# Altium schematic sheet MCU_SCH.SchDoc
size A; SheetNumber: 2; SheetTotal: 3
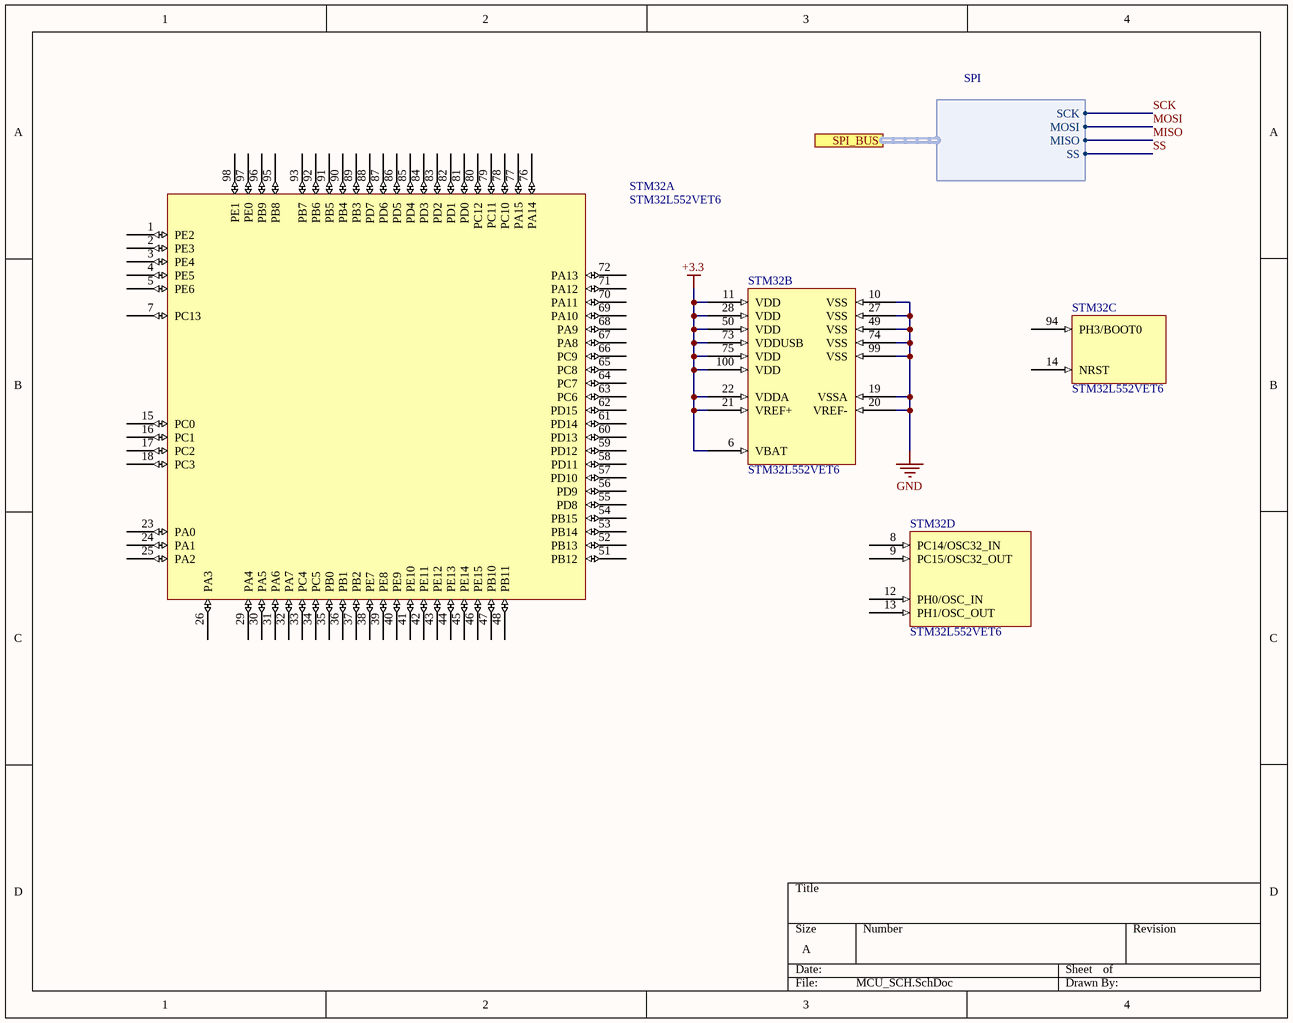
[diagram p0: MCU_SCH.SchDoc]

## Parts
STM32  STM32L552VET6  [TSQFP50P1600X1600X160-100N]  (parts A,B,C,D of 4)

## Ports
SPI_BUS (harness SPI)

## Harnesses
SPI: SCK, MOSI, MISO, SS

## Nets
+3.3: STM32.6(VBAT) STM32.11(VDD) STM32.21(VREF+) STM32.22(VDDA) STM32.28(VDD) STM32.50(VDD) STM32.73(VDDUSB) STM32.75(VDD) STM32.100(VDD)
GND: STM32.10(VSS) STM32.19(VSSA) STM32.20(VREF-) STM32.27(VSS) STM32.49(VSS) STM32.74(VSS) STM32.99(VSS)
MISO: port SPI_BUS.MISO
MOSI: port SPI_BUS.MOSI
SCK: port SPI_BUS.SCK
SS: port SPI_BUS.SS

Not connected (* = marked no-connect by the designer): STM32 1(PE2) 2(PE3) 3(PE4) 4(PE5) 5(PE6) 7(PC13) 8(PC14/OSC32_IN) 9(PC15/OSC32_OUT) 12(PH0/OSC_IN) 13(PH1/OSC_OUT) 14(NRST) 15(PC0) 16(PC1) 17(PC2) 18(PC3) 23(PA0) 24(PA1) 25(PA2) 26(PA3) 29(PA4) 30(PA5) 31(PA6) 32(PA7) 33(PC4) 34(PC5) 35(PB0) 36(PB1) 37(PB2) 38(PE7) 39(PE8) 40(PE9) 41(PE10) 42(PE11) 43(PE12) 44(PE13) 45(PE14) 46(PE15) 47(PB10) 48(PB11) 51(PB12) 52(PB13) 53(PB14) 54(PB15) 55(PD8) 56(PD9) 57(PD10) 58(PD11) 59(PD12) 60(PD13) 61(PD14) 62(PD15) 63(PC6) 64(PC7) 65(PC8) 66(PC9) 67(PA8) 68(PA9) 69(PA10) 70(PA11) 71(PA12) 72(PA13) 76(PA14) 77(PA15) 78(PC10) 79(PC11) 80(PC12) 81(PD0) 82(PD1) 83(PD2) 84(PD3) 85(PD4) 86(PD5) 87(PD6) 88(PD7) 89(PB3) 90(PB4) 91(PB5) 92(PB6) 93(PB7) 94(PH3/BOOT0) 95(PB8) 96(PB9) 97(PE0) 98(PE1)

## Library data of the parts
STM32 = CMP-020-00023-8: Ultra-low-power with FPU Arm Cortex-M33 with Trust Zone, MCU 110 MHz with 512 kbytes of Flash memory; PartId: 1